# Altium schematic sheet Power stage.SchDoc (part 3 of 3)
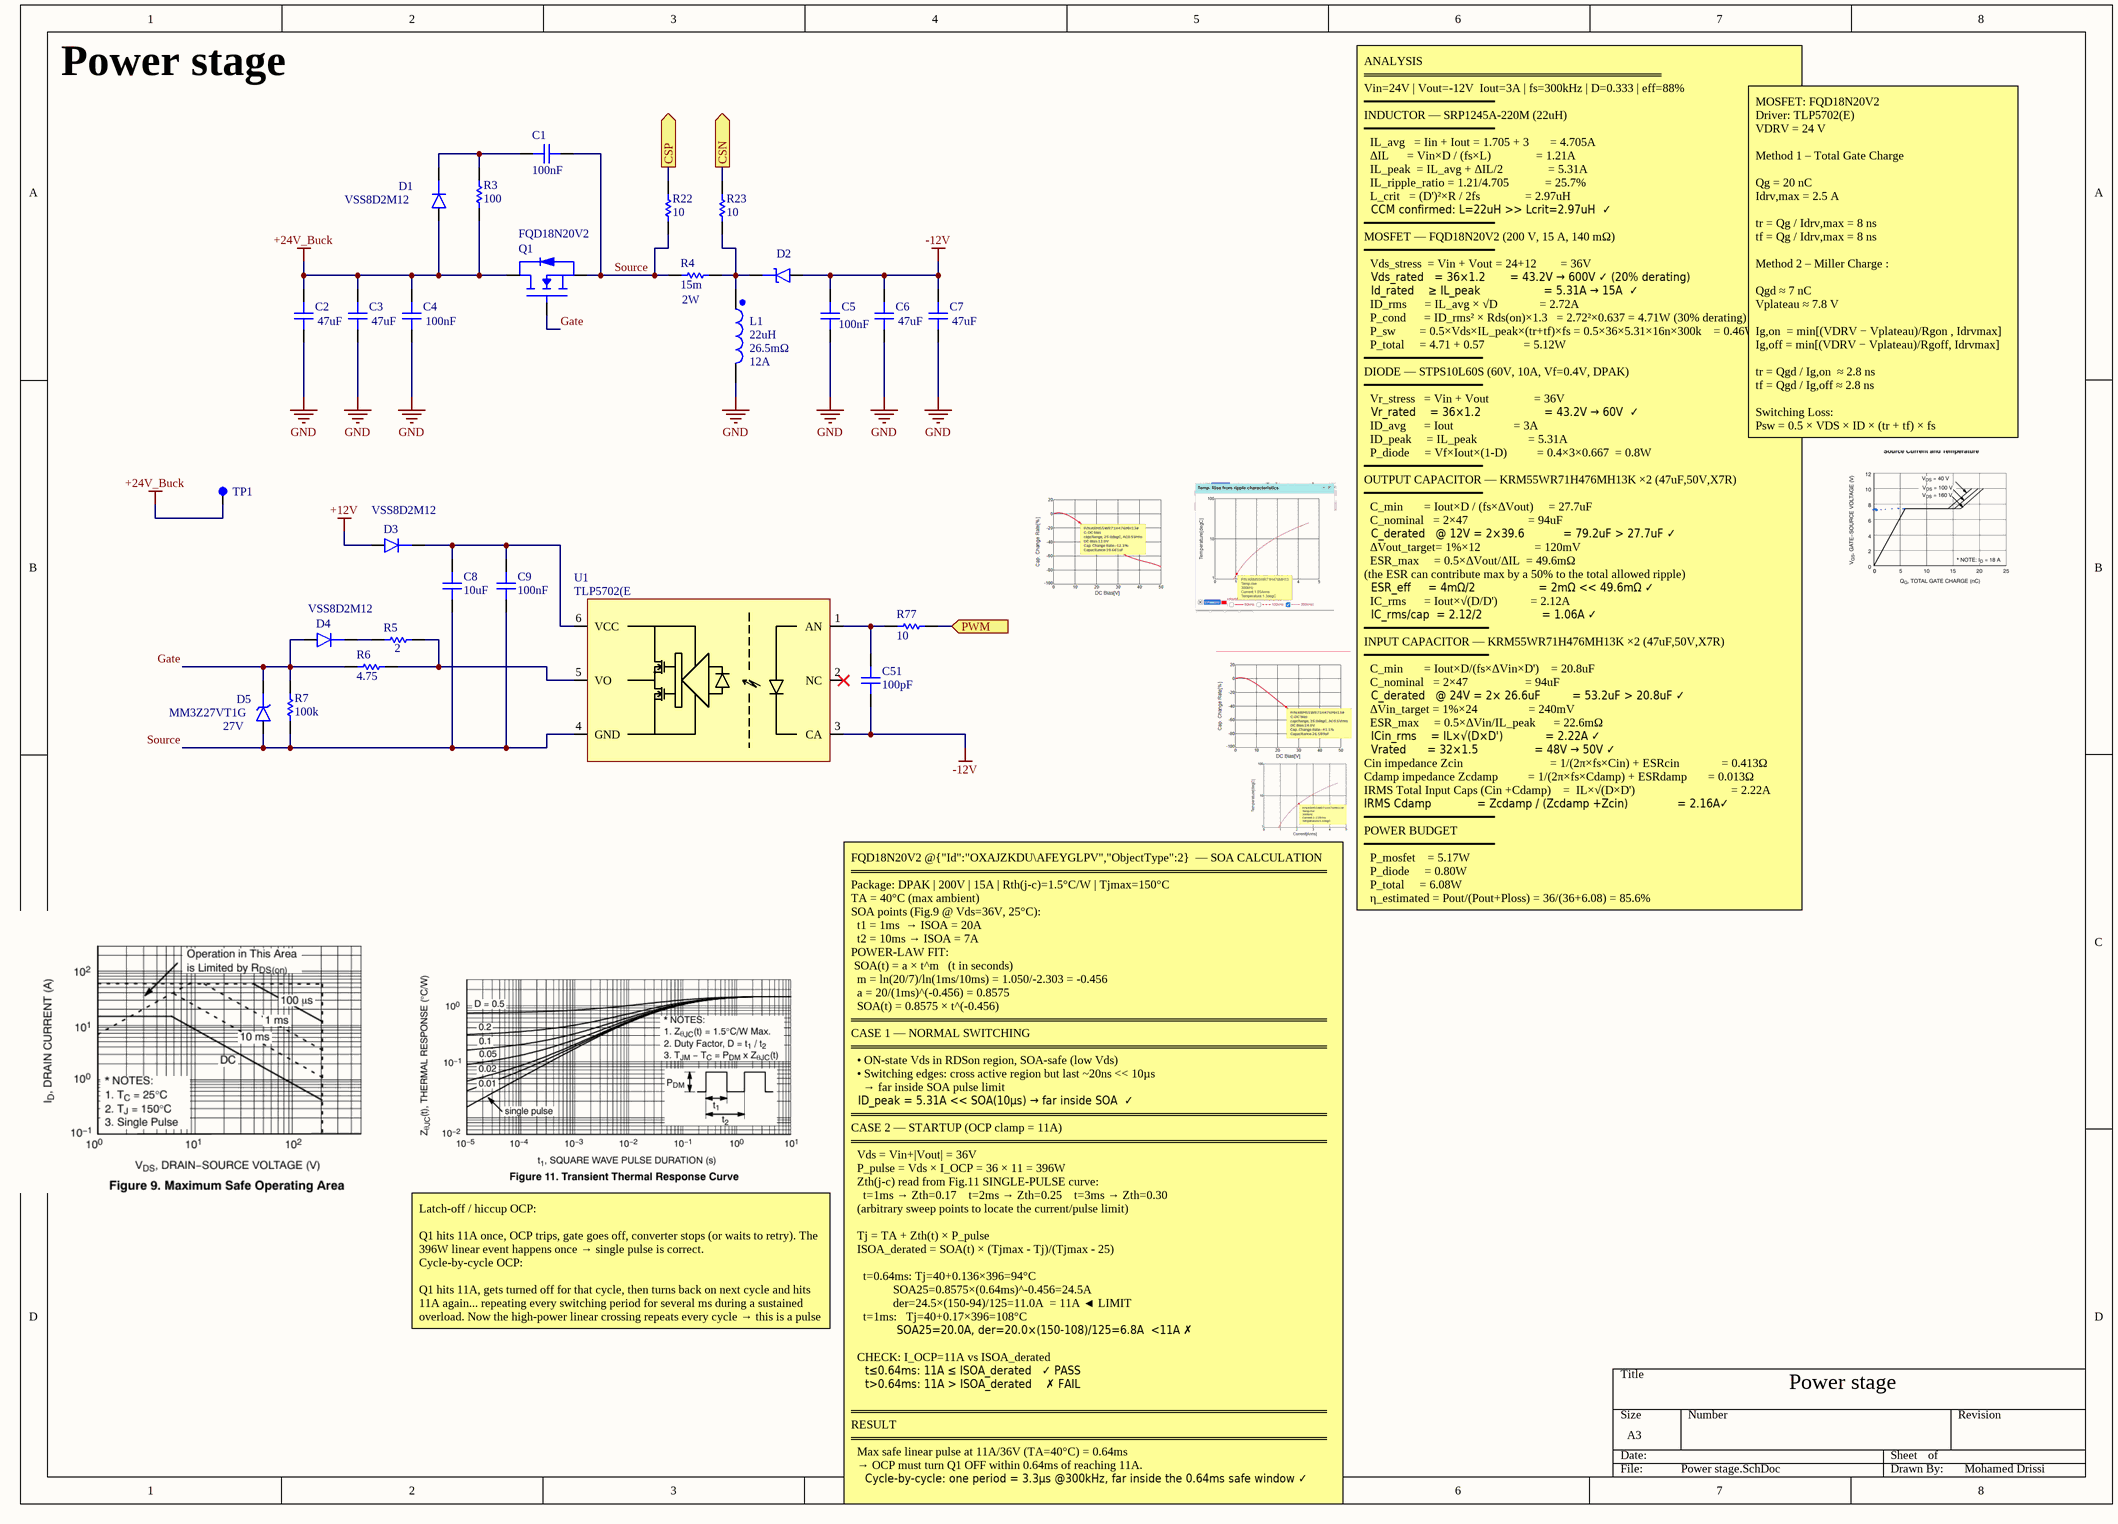
[diagram p2: Power stage.SchDoc]

## Library data of the parts (continued)
R22 R23 = Yageo RC0603FR-0710RL: Res Thick Film 0603 1K Ohm 1% 0.1W(1/10W) ±100ppm/°C Pad SMD T/R / RES SMD 1K OHM 1% 1/10W 0603; Manufacturer: Yageo Group; Manufacturer Part Number: RC0603FR-071KL; Power Rating: 100mW; Value: 1kΩ; Voltage Rating: 50V; Working Voltage: 75V; Supplier: DigiKey; Supplier Part Number: 311-1.00KHRDKR-ND; RoHS: Compliant; Category: Chip SMD Resistors; Stock: 2879129; Pricing: 1=0,1, 10=0,025, 25=0,0188, 50=0,015, 100=0,0122, 250=0,0094, 500=0,00782, 1000=0,00661 (USD); Case/Package: 0603; Case Code (Imperial): 0603; Case Code (Metric): 0603; China RoHS: Non-Compliant; Composition: Thick Film; Contact Plating: Tin; Country of Origin: Mainland China, Taiwan; Depth: 800µm; Export Control Classification Number (ECCN) Code: EAR99; Height: 450µm; Harmonized Tariff Schedule (HTS) Code: 8533.21.00.30; Introduction Date: 2004-10-04; Lead Free: Lead Free; Length: 1.6mm; Lifecycle Status: Production; Max Operating Temperature: 155°C; Military Standard: Not; Min Operating Temperature: -55°C; Mounting Technology: Surface Mount; Pins: 2; Number of Terminals: 2; Packaging: Tape and Reel; Radiation Hardening: No; REACH SVHC: Yes; Schedule B: 8533210045, 8533210045|8533210045|8533210045|8533210045|8533210045|8533210045|8533210045|8533210045|8533210045|8533210045|8533210045|8533210045|8533210045|8533210045|8533210045|8533210045|8533210045|8533210045|8533210045|8533210045|8533210045|8533210045|8533210045|85; Temperature Coefficient: 100ppm/°C; Termination: SMD/SMT; Tolerance: 1%; Voltage Rating (DC): 50V; Width: 800µm; ComponentLink1URL: https://datasheet.octopart.com:443/RC0603FR-071KL-Yageo-datasheet-175887523.pdf?src-supplier=Newark; ComponentLink1Description: https://datasheet.octopart.com:443/RC0603FR-071KL-Yageo-datasheet-175887523.pdf?src-supplier=Newark; ComponentLink2URL: https://datasheet.octopart.com:443/RC0603FR-071KL-Yageo-datasheet-34211833.pdf?src-supplier=Newark; ComponentLink2Description: https://datasheet.octopart.com:443/RC0603FR-071KL-Yageo-datasheet-34211833.pdf?src-supplier=Newark; ComponentLink3URL: https://datasheet.octopart.com:443/RC0603FR-071KL-Yageo-datasheet-12596169.pdf?src-supplier=Newark; ComponentLink3Description: https://datasheet.octopart.com:443/RC0603FR-071KL-Yageo-datasheet-12596169.pdf?src-supplier=Newark; ComponentLink4URL: https://datasheet.octopart.com:443/RC0603FR-071KL-Yageo-datasheet-499455.pdf?src-supplier=Newark; ComponentLink4Description: https://datasheet.octopart.com:443/RC0603FR-071KL-Yageo-datasheet-499455.pdf?src-supplier=Newark; ComponentLink5URL: https://datasheet.octopart.com:443/RC0603FR-071KL-Yageo-datasheet-503470.pdf?src-supplier=Newark; ComponentLink5Description: https://datasheet.octopart.com:443/RC0603FR-071KL-Yageo-datasheet-503470.pdf?src-supplier=Newark; ComponentLink6URL: https://datasheet.octopart.com:443/RC0603FR-071KL-Yageo-datasheet-62067350.pdf?src-supplier=element14+APAC; ComponentLink6Description: https://datasheet.octopart.com:443/RC0603FR-071KL-Yageo-datasheet-62067350.pdf?src-supplier=element14+APAC; ComponentLink7URL: https://datasheet.octopart.com:443/RC0603FR-071KL-Yageo-datasheet-21426514.pdf?src-supplier=element14+APAC; ComponentLink7Description: https://datasheet.octopart.com:443/RC0603FR-071KL-Yageo-datasheet-21426514.pdf?src-supplier=element14+APAC; ComponentLink8URL: https://datasheet.octopart.com:443/RC0603FR-071KL-Yageo-datasheet-141265859.pdf?src-supplier=Upverter; ComponentLink8Description: https://datasheet.octopart.com:443/RC0603FR-071KL-Yageo-datasheet-141265859.pdf?src-supplier=Upverter; ComponentLink9URL: https://datasheet.octopart.com:443/RC0603FR-071KL-Yageo-datasheet-103092701.pdf?src-supplier=Upverter; ComponentLink9Description: https://datasheet.octopart.com:443/RC0603FR-071KL-Yageo-datasheet-103092701.pdf?src-supplier=Upverter; ComponentLink10URL: https://sigma.octopart.com:443/138820526/technical_drawing/Yageo-RC0603FR-071KL.pdf?src-supplier=Upverter; ComponentLink10Description: https://sigma.octopart.com:443/138820526/technical_drawing/Yageo-RC0603FR-071KL.pdf?src-supplier=Upverter; ComponentLink11URL: https://datasheet.octopart.com:443/RC0603FR-071KL-Yageo-datasheet-68297981.pdf?src-supplier=Upverter; ComponentLink11Description: https://datasheet.octopart.com:443/RC0603FR-071KL-Yageo-datasheet-68297981.pdf?src-supplier=Upverter; ComponentLink12URL: https://datasheet.octopart.com:443/RC0603FR-071KL-Yageo-datasheet-8328172.pdf?src-supplier=Farnell; ComponentLink12Description: https://datasheet.octopart.com:443/RC0603FR-071KL-Yageo-datasheet-8328172.pdf?src-supplier=Farnell; ComponentLink13URL: https://datasheet.octopart.com:443/RC0603FR-071KL-Yageo-datasheet-13691069.pdf?src-supplier=Farnell; ComponentLink13Description: https://datasheet.octopart.com:443/RC0603FR-071KL-Yageo-datasheet-13691069.pdf?src-supplier=Farnell; ComponentLink14URL: https://datasheet.octopart.com:443/RC0603FR-071KL-Yageo-datasheet-15599030.pdf?src-supplier=Seeed+Studio; ComponentLink14Description: https://datasheet.octopart.com:443/RC0603FR-071KL-Yageo-datasheet-15599030.pdf?src-supplier=Seeed+Studio; ComponentLink15URL: https://datasheet.octopart.com:443/RC0603FR-071KL-Yageo-Group-datasheet-176638170.pdf?src-supplier=Future+Electronics; ComponentLink15Description: https://datasheet.octopart.com:443/RC0603FR-071KL-Yageo-Group-datasheet-176638170.pdf?src-supplier=Future+Electronics; ComponentLink16URL: https://datasheet.octopart.com:443/RC0603FR-071KL-Yageo-datasheet-164759695.pdf?src-supplier=Future+Electronics; ComponentLink16Description: https://datasheet.octopart.com:443/RC0603FR-071KL-Yageo-datasheet-164759695.pdf?src-supplier=Future+Electronics; ComponentLink17URL: https://datasheet.octopart.com:443/RC0603FR-071KL-Yageo-datasheet-137700087.pdf?src-supplier=Future+Electronics; ComponentLink17Description: https://datasheet.octopart.com:443/RC0603FR-071KL-Yageo-datasheet-137700087.pdf?src-supplier=Future+Electronics; ComponentLink18URL: https://datasheet.octopart.com:443/RC0603FR071KL-Yageo-datasheet-27584510.pdf?src-supplier=Future+Electronics; ComponentLink18Description: https://datasheet.octopart.com:443/RC0603FR071KL-Yageo-datasheet-27584510.pdf?src-supplier=Future+Electronics; ComponentLink19URL: https://datasheet.octopart.com:443/RC0603FR-071KL-Yageo-datasheet-8324193.pdf?src-supplier=Future+Electronics; ComponentLink19Description: https://datasheet.octopart.com:443/RC0603FR-071KL-Yageo-datasheet-8324193.pdf?src-supplier=Future+Electronics; ComponentLink20URL: https://datasheet.octopart.com:443/RC0603FR-071KL-Yageo-datasheet-79472498.pdf?src-supplier=Megastar; ComponentLink20Description: https://datasheet.octopart.com:443/RC0603FR-071KL-Yageo-datasheet-79472498.pdf?src-supplier=Megastar; ComponentLink21URL: https://datasheet.octopart.com/RC0603FR-071KL-Yageo-datasheet-73766026.pdf; ComponentLink21Description: https://datasheet.octopart.com/RC0603FR-071KL-Yageo-datasheet-73766026.pdf; ComponentLink22URL: https://datasheet.octopart.com:443/RC0603FR-071KL-Yageo-datasheet-118562.pdf?src-supplier=DigiKey; ComponentLink22Description: https://datasheet.octopart.com:443/RC0603FR-071KL-Yageo-datasheet-118562.pdf?src-supplier=DigiKey; ComponentLink23URL: http://sigma.octopart.com:80/conflict_mineral_statement/Yageo-company-3.pdf?src-supplier=Compliance+Statements; ComponentLink23Description: http://sigma.octopart.com:80/conflict_mineral_statement/Yageo-company-3.pdf?src-supplier=Compliance+Statements; ComponentLink24URL: http://sigma.octopart.com:80/rohs_statement/Yageo-company-2.pdf?src-supplier=Compliance+Statements; ComponentLink24Description: http://sigma.octopart.com:80/rohs_statement/Yageo-company-2.pdf?src-supplier=Compliance+Statements
R77 = Yageo RT0603BRE0710RL: Fixed Resistor, Thin Film, 0.1W, 10ohm, 75V, 0.1% +/-Tol, 50ppm/Cel, Surface Mount, 0603; Manufacturer: Yageo Group; Max Power Dissipation: 100mW; Temperature Coefficient: 50ppm/°C; Voltage Rating (DC): 50V; Supplier: DigiKey; Supplier Part Number: 13-RT0603BRE0710RLDKR-ND; Manufacturer Part Number: RT0603BRE0710RL; RoHS: Compliant; Category: Chip SMD Resistors; Stock: 24199; Pricing: 1=0,19, 10=0,163, 25=0,1512, 50=0,1428, 100=0,1349, 250=0,12532, 500=0,11876, 1000=0,11281 (USD); Case/Package: 0603; Case Code (Metric): 0603; China RoHS: Non-Compliant; Composition: Thin Film; Height: 450µm; Lead Free: Lead Free; Length: 1.6mm; Lifecycle Status: Production; Max Operating Temperature: 155°C; Min Operating Temperature: -55°C; Mounting Technology: Surface Mount; Number of Terminals: 2; Number of Terminations: 2; Packaging: Tape & Reel (TR); Power Rating: 100mW; REACH SVHC: Yes; Tolerance: 0.1%; Voltage Rating: 75V; Width: 800µm; Working Voltage: 75V; ComponentLink1URL: https://datasheet.octopart.com:443/RT0603BRE0710RL-Yageo-datasheet-176402239.pdf?src-supplier=Future+Electronics; ComponentLink1Description: https://datasheet.octopart.com:443/RT0603BRE0710RL-Yageo-datasheet-176402239.pdf?src-supplier=Future+Electronics; ComponentLink2URL: https://datasheet.octopart.com:443/RT0603BRE0710RL-Yageo-datasheet-169971040.pdf?src-supplier=Future+Electronics; ComponentLink2Description: https://datasheet.octopart.com:443/RT0603BRE0710RL-Yageo-datasheet-169971040.pdf?src-supplier=Future+Electronics; ComponentLink3URL: https://datasheet.octopart.com:443/RT0603BRE0710RL-Yageo-datasheet-96443642.pdf?src-supplier=Upverter; ComponentLink3Description: https://datasheet.octopart.com:443/RT0603BRE0710RL-Yageo-datasheet-96443642.pdf?src-supplier=Upverter; ComponentLink4URL: https://datasheet.octopart.com/RT0603BRE0710RL-Yageo-datasheet-86813807.pdf; ComponentLink4Description: https://datasheet.octopart.com/RT0603BRE0710RL-Yageo-datasheet-86813807.pdf; ComponentLink5URL: http://sigma.octopart.com:80/conflict_mineral_statement/Yageo-company-3.pdf?src-supplier=Compliance+Statements; ComponentLink5Description: http://sigma.octopart.com:80/conflict_mineral_statement/Yageo-company-3.pdf?src-supplier=Compliance+Statements; ComponentLink6URL: http://sigma.octopart.com:80/rohs_statement/Yageo-company-2.pdf?src-supplier=Compliance+Statements; ComponentLink6Description: http://sigma.octopart.com:80/rohs_statement/Yageo-company-2.pdf?src-supplier=Compliance+Statements
TP1 = Keystone 5000: Cable Wrap, 1/2 Inch, Polyethylene, Natural, 50 Ft, Spirap Series | TE Connectivity 500002-1; Body Material: Bronze, PBT; Hole Diameter: 1.6mm; Inside Diameter: 1.27mm; Insulation: Insulated; Number of Contacts: 1; Outside Diameter: 2.54mm; Plating: Silver; Supplier: Future Electronics; Supplier Part Number: 5000; Manufacturer: Keystone; Manufacturer Part Number: 5000; RoHS: Compliant; Category: Test Points; Stock: 278803; Pricing: 200=0,0998, 500=0,0974, 1500=0,0947, 3000=0,093, 10000=0,088 (USD); Color: Red; Contact Material: Silver; Contact Plating: Silver; Flammability Rating: UL94 V-0; Height: 4.72mm; Housing Color: Red; Lead Free: Lead Free; Length: 7.62mm; Lifecycle Status: Production; Material: Bronze, Nylon, Silver; Mounting Technology: PCB, Through Hole; Number of Ports: 1; Orientation: Straight; Packaging: Bulk; REACH SVHC: Yes; ComponentLink1URL: https://datasheet.octopart.com:443/5000-Keystone-datasheet-138896739.pdf?src-supplier=Upverter; ComponentLink1Description: https://datasheet.octopart.com:443/5000-Keystone-datasheet-138896739.pdf?src-supplier=Upverter; ComponentLink2URL: https://datasheet.octopart.com:443/5000-Keystone-datasheet-15716159.pdf?src-supplier=IHS; ComponentLink2Description: https://datasheet.octopart.com:443/5000-Keystone-datasheet-15716159.pdf?src-supplier=IHS; ComponentLink3URL: https://datasheet.octopart.com:443/5000-Keystone-datasheet-9590016.pdf?src-supplier=Sager+Electronics; ComponentLink3Description: https://datasheet.octopart.com:443/5000-Keystone-datasheet-9590016.pdf?src-supplier=Sager+Electronics; ComponentLink4URL: https://datasheet.octopart.com:443/5000-Keystone-datasheet-23674.pdf?src-supplier=SOS+electronic; ComponentLink4Description: https://datasheet.octopart.com:443/5000-Keystone-datasheet-23674.pdf?src-supplier=SOS+electronic; ComponentLink5URL: https://datasheet.octopart.com:443/5000-Keystone-datasheet-549598.pdf?src-supplier=Farnell; ComponentLink5Description: https://datasheet.octopart.com:443/5000-Keystone-datasheet-549598.pdf?src-supplier=Farnell; ComponentLink6URL: https://datasheet.octopart.com:443/5000-Keystone-datasheet-60278094.pdf?src-supplier=Future+Electronics; ComponentLink6Description: https://datasheet.octopart.com:443/5000-Keystone-datasheet-60278094.pdf?src-supplier=Future+Electronics; ComponentLink7URL: https://datasheet.octopart.com:443/5000-Keystone-datasheet-542585.pdf?src-supplier=Future+Electronics; ComponentLink7Description: https://datasheet.octopart.com:443/5000-Keystone-datasheet-542585.pdf?src-supplier=Future+Electronics; ComponentLink8URL: https://datasheet.octopart.com:443/5000-Keystone-datasheet-10925273.pdf?src-supplier=Factory+Futures; ComponentLink8Description: https://datasheet.octopart.com:443/5000-Keystone-datasheet-10925273.pdf?src-supplier=Factory+Futures; ComponentLink9URL: https://datasheet.octopart.com:443/5000-Keystone-datasheet-15983577.pdf?src-supplier=element14+APAC; ComponentLink9Description: https://datasheet.octopart.com:443/5000-Keystone-datasheet-15983577.pdf?src-supplier=element14+APAC; ComponentLink10URL: https://datasheet.octopart.com:443/5000-Keystone-datasheet-6528.pdf?src-supplier=RS+(Formerly+Allied+Electronics); ComponentLink10Description: https://datasheet.octopart.com:443/5000-Keystone-datasheet-6528.pdf?src-supplier=RS+(Formerly+Allied+Electronics)
U1 = Toshiba TLP5702(E: Optocoupler DC-IN Single Totem-Pole-OUT 6-Pin SOIC Magazine; Forward Current: 10mA; Isolation Voltage: 5000Vrms; Min Supply Voltage: 15V; Number of Circuits: 1; Propagation Delay: 200ns; Response Time: 15ns; Supplier: DigiKey; Supplier Part Number: TLP5702(E-ND; Manufacturer: Toshiba; Manufacturer Part Number: TLP5702(E; RoHS: Compliant; Category: Digital Isolators; Stock: 95; Pricing: 1=1,44, 10=1,018, 125=0,74496, 500=0,65032, 1000=0,61339, 2000=0,58209, 5000=0,54792, 10000=0,52666 (USD); Case/Package: SO; Lifecycle Status: Production; Max Operating Temperature: 100°C; Min Operating Temperature: -40°C; Mounting Technology: Surface Mount; Number of Elements: 1; Packaging: Bulk; Radiation Hardening: No; Schedule B: 8541408000; ComponentLink1URL: https://datasheet.octopart.com:443/TLP5702%28E-Toshiba-datasheet-181397918.pdf?src-supplier=IHS; ComponentLink1Description: https://datasheet.octopart.com:443/TLP5702%28E-Toshiba-datasheet-181397918.pdf?src-supplier=IHS